# Altium project Supply_unit-RM_1.PrjPcb
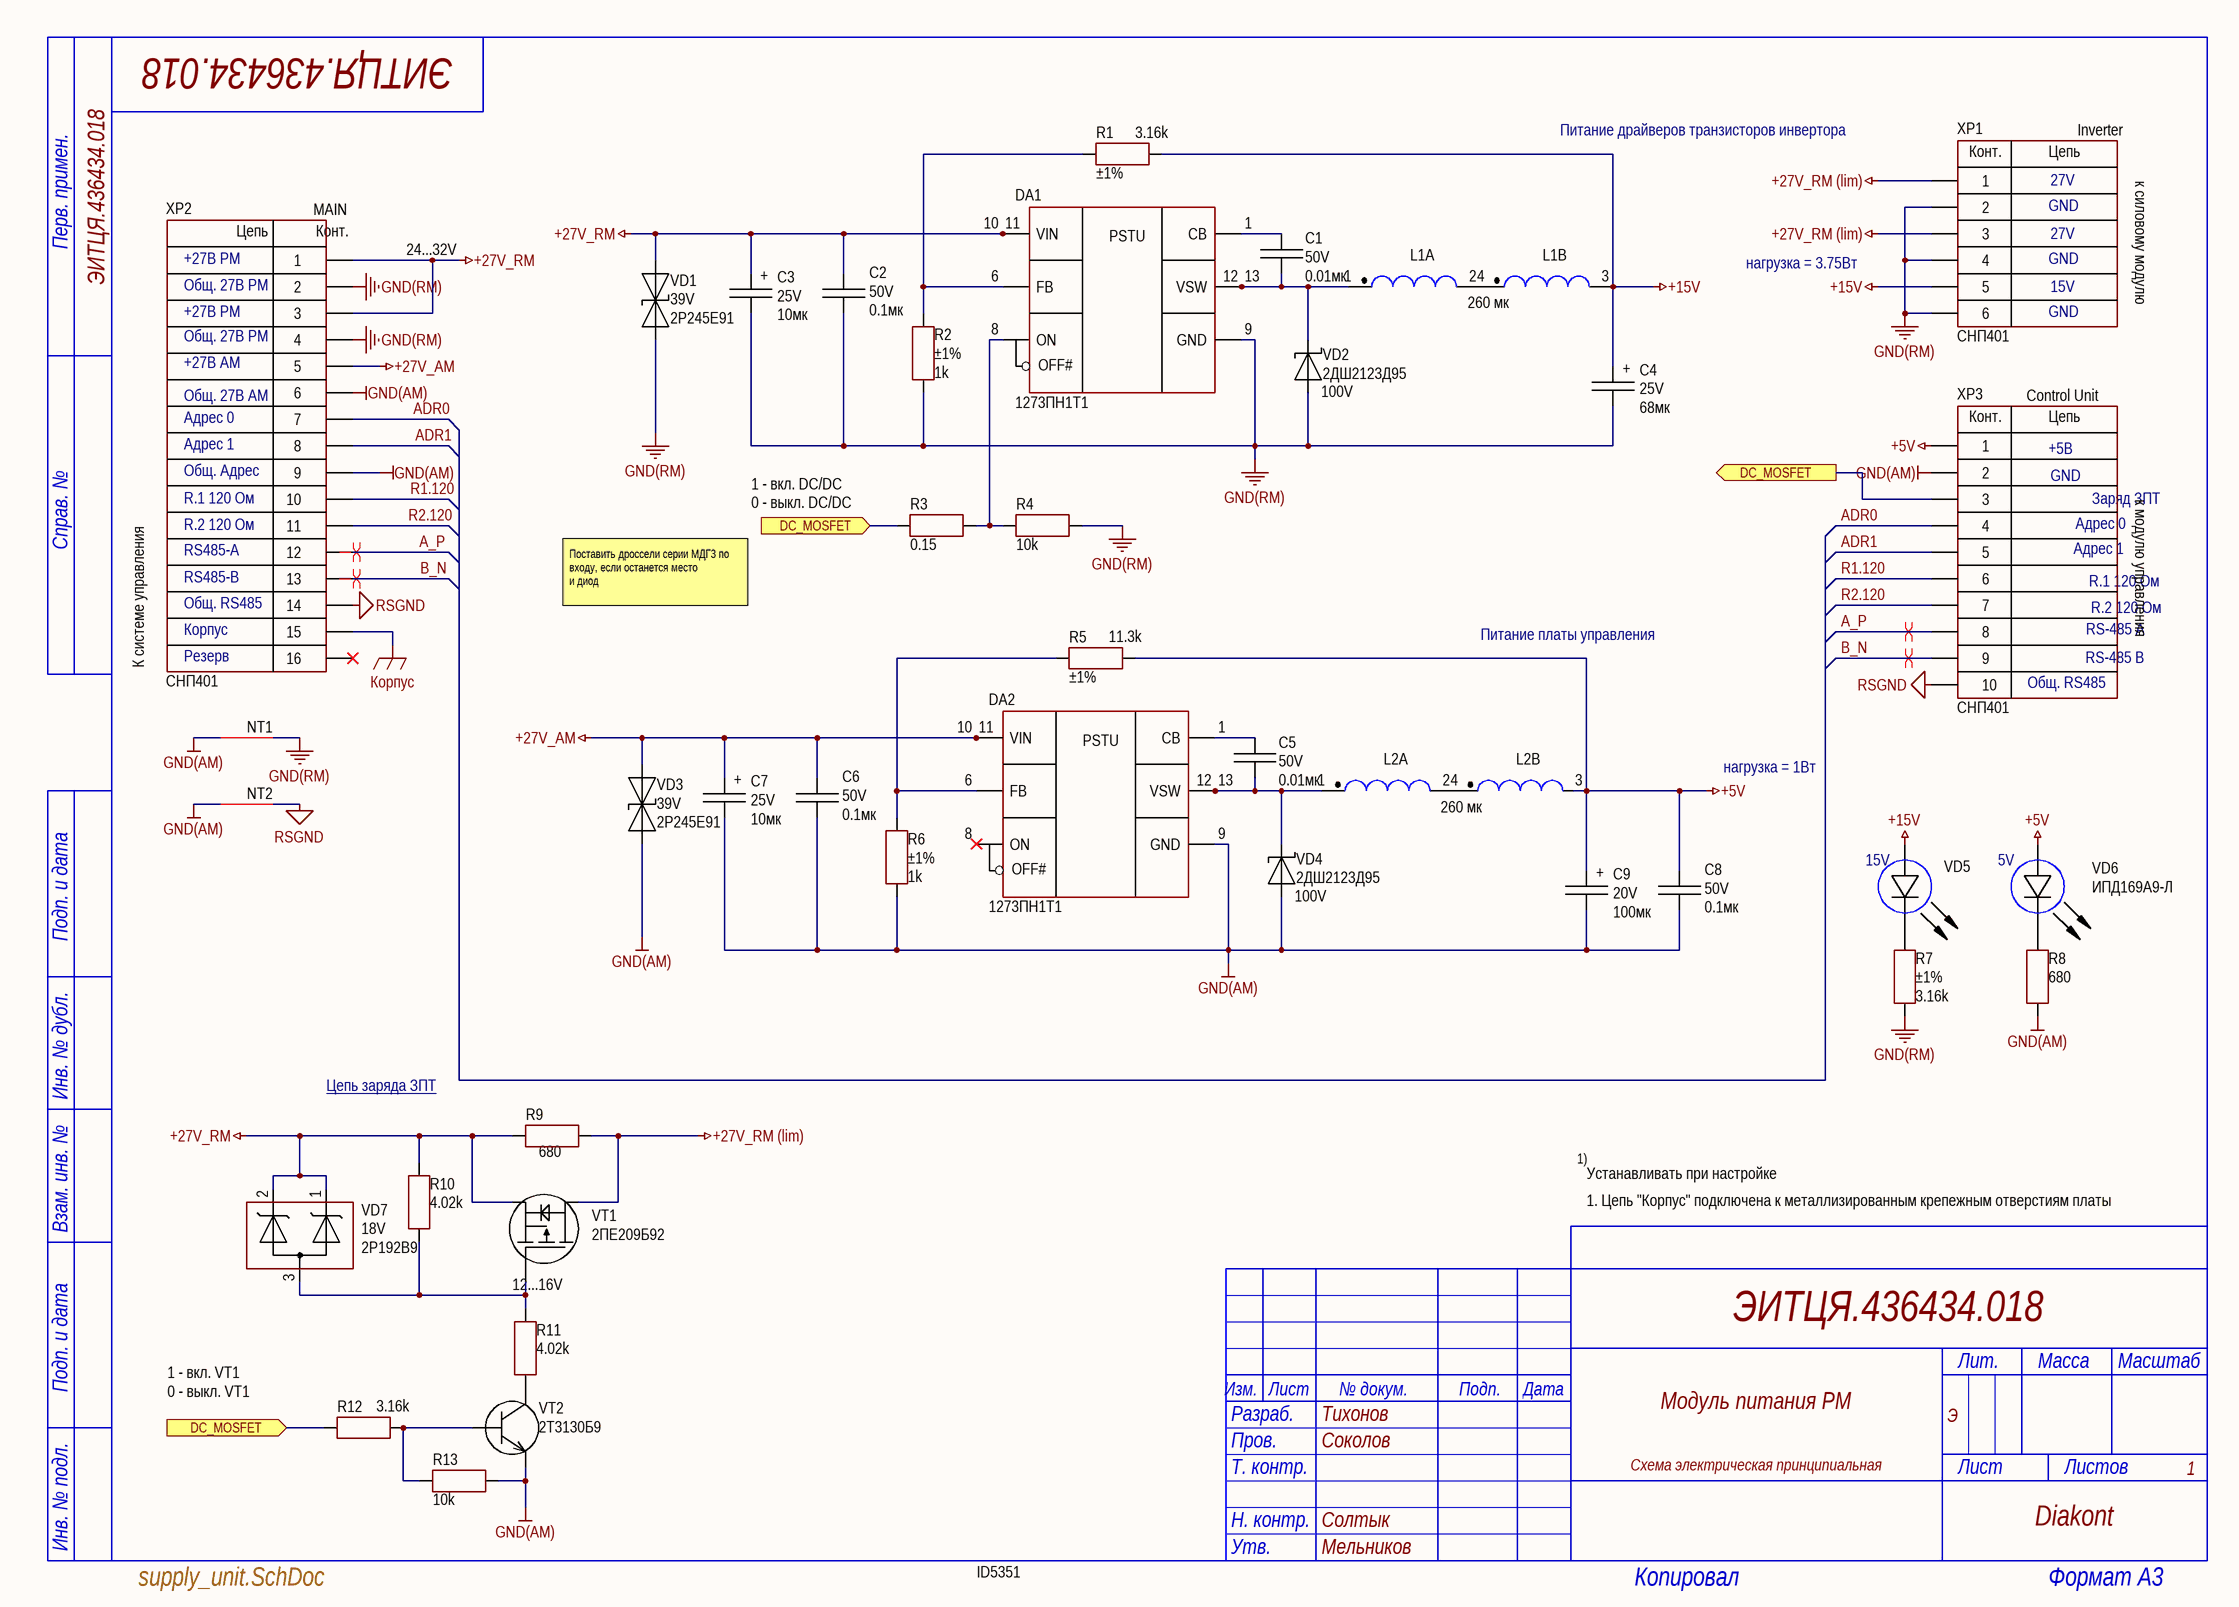
[diagram p0: supply_unit.SchDoc]
1 sheet, 40 parts. Net scope: flat (ports and power ports of the same name join across sheets).
Board file: PCB_supply unit.PcbDoc

## Sheet supply_unit.SchDoc: Модуль питания РМ
size 420 x 297 mm; Date: 2019-11-22; ApprovedBy: Мельников; CheckedBy: Соколов; CompanyName: Diakont; DrawnBy: Тихонов; DocumentNumber: ЭИТЦЯ.436434.018; Revision: A; SheetTotal: 1; DocumentType: Схема электрическая принципиальная; Liter: Э; NormControl: Солтык; PageSetup: Record=PageOptions|CenterHorizontal=True|CenterVertical=True|PrintScale=0.96|XCorrection=1.00|YCorrection=1.00|PrintKind=1|BorderSize=5000000|LeftOffset=0|BottomOffset=0|Orientation=2|PaperLength=1000|PaperWidth=1000|Scale=100|PaperSource=7|PrintQuality=-4|MediaType=1|DitherType=10|PaperKind=A3|PrintScaleMode=1; FirstApp: ЭИТЦЯ.436434.018; Language: en; ResponsibleDept: DED; DocumentStatus: Released; DecimalNumber: {DecimalNumber}

### Parts
C1  value 0.01мк  Voltage: 50V  [CAP: 0603+0805]
C2  value 0.1мк  Voltage: 50V  [CAP: 0805+1206]
C3  value 10мк  Polarity: +  Voltage: 25V  [CAP: TANTAL-E]
C4  value 68мк  Polarity: +  Voltage: 25V  [CAP: TANTAL-E]
C5  value 0.01мк  Voltage: 50V  [CAP: 0603+0805]
C6  value 0.1мк  Voltage: 50V  [CAP: 0805+1206]
C7  value 10мк  Polarity: +  Voltage: 25V  [CAP: TANTAL-E]
C8  value 0.1мк  Voltage: 50V  [CAP: 0805+1206]
C9  value 100мк  Polarity: +  Voltage: 20V  [CAP: TANTAL-E]
DA1  (no value)  [401.14-5М]
DA2  (no value)  [401.14-5М]
L1  value 260 мк  [IND: DFPK7_5]  (hidden comment: ДФПК7,5-2/x)  (parts A,B of 2)
L2  value 260 мк  [IND: DFPK7_5]  (hidden comment: ДФПК7,5-2/x)  (parts A,B of 2)
NT1  (no value)  [NetTie_0603]  (net tie, no BOM)
NT2  (no value)  [NetTie_0603]  (net tie, no BOM)
R1  value 3.16k  Tolerance: ±1%  [RES: 0603P]
R2  value 1k  Tolerance: ±1%  [RES: 0603P]
R3  value 0.15  [RES: 0603P]
R4  value 10k  [RES: 0603P]
R5  value 11.3k  Tolerance: ±1%  [RES: 0603P]
R6  value 1k  Tolerance: ±1%  [RES: 0603P]
R7  value 3.16k  Tolerance: ±1%  [RES: 0603P]
R8  value 680  [RES: 0603P]
R9  value 680  [RES: 0805P]
R10  value 4.02k
R11  value 4.02k
R12  value 3.16k  [RES: 0603P]
R13  value 10k  [RES: 0603P]
VD1  Voltage: 39V  PartNumber: 2Р245Е91  [DIODE: SMB]
VD2  Voltage: 100V  PartNumber: 2ДШ2123Д95  [КТ-99-1]  (hidden comment: ВЗПП Сборка Воронеж)
VD3  Voltage: 39V  PartNumber: 2Р245Е91  [DIODE: SMB]
VD4  Voltage: 100V  PartNumber: 2ДШ2123Д95  [КТ-99-1]  (hidden comment: ВЗПП Сборка Воронеж)
VD5  CommentText: 15V  [LED: 0603G]
VD6  PartNumber: ИПД169А9-Л  CommentText: 5V  [LED: 0603G]
VD7  Voltage: 18V  PartNumber: 2Р192В9  [SOT23]
VT1  PartNumber: 2ПЕ209Б92  [DPAK]
VT2  PartNumber: 2Т3130Б9  [SOT23]
XP1  CommentText: СНП401  [CON: M80-5000605]
XP2  CommentText: СНП401  [CON: M80-5001605]
XP3  CommentText: СНП401  [CON: HR M80-500S10]

### Ports
DC_MOSFET (in), DC_MOSFET (out)

### Nets
+5V: C8.2 C9.2 L2.3 R5.2 VD6.1(A) XP3.1
+15V: C4.2 L1.3 R1.2 VD5.1(A) XP1.5
+27V_AM: C6.2 C7.2 DA2.10(VIN) DA2.11(VIN) VD3.2(C) XP2.5
+27V_RM: C2.2 C3.2 DA1.10(VIN) DA1.11(VIN) R9.1 R10.1 VD1.2(C) VD7.1(K1) VD7.2(K2) VT1.2(S) XP2.1 XP2.3
+27V_RM (lim): R9.2 VT1.3(D) XP1.1 XP1.3
GND(AM): C6.1 C7.1 C8.1 C9.1 DA2.9(GND) NT1.1 NT2.1 R6.2 R8.2 R13.1 VD3.1(A) VD4.A VT2.2(E) XP2.6 XP2.9 XP3.2
GND(RM): C2.1 C3.1 C4.1 DA1.9(GND) NT1.2 R2.2 R4.1 R7.1 VD1.1(A) VD2.A XP1.2 XP1.4 XP1.6 XP2.2 XP2.4
RSGND: NT2.2 XP2.14 XP3.10
Корпус: XP2.15
A_P: XP2.12 XP3.8
ADR0: XP2.7 XP3.4
ADR1: XP2.8 XP3.5
B_N: XP2.13 XP3.9
DC_MOSFET: R3.1 R12.1 XP3.3 ; port DC_MOSFET
R1.120: XP2.10 XP3.6
R2.120: XP2.11 XP3.7
NetC1_1: C1.1 DA1.12(VSW) DA1.13(VSW) L1.1 VD2.C
NetC1_2: C1.2 DA1.1(CB)
NetC5_1: C5.1 DA2.12(VSW) DA2.13(VSW) L2.1 VD4.C
NetC5_2: C5.2 DA2.1(CB)
NetDA1_6: DA1.6(FB) R1.1 R2.1
NetDA1_8: DA1.8(ON) R3.2 R4.2
NetDA2_6: DA2.6(FB) R5.1 R6.1
NetL1_2: L1.2 L1.4
NetL2_2: L2.2 L2.4
NetR7_2: R7.2 VD5.2(C)
NetR8_1: R8.1 VD6.2(C)
NetR10_2: R10.2 R11.1 VD7.3(A) VT1.1(G)
NetR11_2: R11.2 VT2.3(C)
NetR12_2: R12.2 R13.2 VT2.1(B)

Not connected (* = marked no-connect by the designer): DA2 8(ON)*; XP2 16*

### Layout directives
differential pair: (no net found under the mark), A_P, B_N

### Notes on the sheet
- Питание драйверов транзисторов инвертора
- 27V
- Inverter
- к силовому модулю
- +27В РМ
- (near XP2) MAIN
- (near XP2) 24...32V
- GND
- (near XP2) Общ. 27В РМ
- (near L1) нагрузка = 3.75Вт
- 15V
- (near XP2) Общ. 27В АМ
- +27В АМ
- Control Unit
- Адрес 0
- Адрес 1
- +5В
- К системе управления
- R.1 120 Ом
- R.2 120 Ом
- Общ. Адрес
- (near R3) 1 - вкл. DC/DC
  0 - выкл. DC/DC
- Заряд ЗПТ
- к модулю управления
- RS485-A
- RS485-B
- Поставить дроссели серии МДГ3 по входу, если останется место
  и диод
- (near XP3) R.1 120 Ом
- Общ. RS485
- Корпус
- Резерв
- Питание платы управления
- RS-485 B
- RS-485 A
- (near XP3) R.2 120 Ом
- (near L2) нагрузка = 1Вт
- Цепь заряда ЗПТ
- 1)
- Устанавливать при настройке
- 1. Цепь "Корпус" подключена к металлизированным крепежным отверстиям платы
- (near VT1) 12...16V
- 1 - вкл. VT1
  0 - выкл. VT1
- ID5351
- Перв. примен.
- Справ. №
- Подп. и дата
- Инв. № дубл.
- Взам. инв. №
- Изм.
- Лист
- № докум.
- Подп.
- Дата
- Лит.
- Масса
- Масштаб
- Разраб.
- Пров.
- Т. контр.
- Листов
- Инв. № подл.
- Н. контр.
- Утв.
- Копировал
- Формат A3
- (in symbol 1273ПН1T1) PSTU; OFF#
- (in symbol M80-5000605 Harwin) Конт.; Цепь
- (in symbol M80-5001005 Harwin) Конт.; Цепь
- (in symbol M80-5001205 Harwin_1) Цепь; Конт.

### Library data of the parts
C1 C5 = Ceramic_0603: Manufacturer: Монолит; PartNumber: К10-84в-1608М-50В-0,01 мкФ ±10%-Н20-N-A; ValueManufacturerPartNumber: Ceramic capacitor, 0.01мк, Н20, ±10%, 50V, 0603,; TypeCapacitor: Ceramic capacitor; Tolerance: ±10%; TypeDielectric: Н20; Analog: MAX 00123301 (K10-17в - 0805); Package: 0603; HelpURL: http://www.monolit.vitebsk.by/Files/K10-84.pdf
C2 C6 C8 = Ceramic_1210: Manufacturer: Монолит; PartNumber: К10-84в-2012М-50В-0,1 мкФ +80/-20%-Н90-N-A; ValueManufacturerPartNumber: Ceramic capacitor, 0.1мк, Н20, ±10%, 50V, 0805,; TypeCapacitor: Ceramic capacitor; Tolerance: ±10%; TypeDielectric: Н20; Analog: MAX 00123747 (К10-17в - с1206); Package: 0805; HelpURL: http://www.monolit.vitebsk.by/Files/K10-84.pdf
C3 C7 = Tantal_E: Manufacturer: Элеконд; PartNumber: К53-68 "E"-50 В-10мкф ±10%; ValueManufacturerPartNumber: Tantalum capacitor, 10мк, 25V, ±10%, 0.7 Ом, case E, -60...+125°C; Impedance: 0.7 Ом; Tolerance: ±10%; TypeCapacitor: Tantalum capacitor; MAX: 00145440; Analog: 00132739 (pin-to-pin на 15мкФ); Package: case E; HelpURL: https://eandc.ru/pdf/kondensator/k53-68.pdf; Temperature: -60...+125°C
C4 = Tantal_E: Manufacturer: Элеконд; PartNumber: К53-68 "E"-25 В-68мкф ±10%; ValueManufacturerPartNumber: Tantalum capacitor, 68мк, 25V, ±10%, 0.7 Ом, case E, -60...+125°C; Impedance: 0.7 Ом; Tolerance: ±10%; TypeCapacitor: Tantalum capacitor; MAX: 00145468; Package: case E; HelpURL: https://eandc.ru/pdf/kondensator/k53-68.pdf; Temperature: -60...+125°C
C9 = Tantal_E: Manufacturer: Элеконд; PartNumber: К53-68 "E"-20 В-100 мкф ±10%; ValueManufacturerPartNumber: Tantalum capacitor, 100мк, 20V, ±10%, 0.5-0.7 Ом, case E, -60...+125°C; Impedance: 0.5-0.7 Ом; Tolerance: ±10%; TypeCapacitor: Tantalum capacitor; MAX: 00129948; Package: case E; HelpURL: https://eandc.ru/pdf/kondensator/k53-68.pdf; Temperature: -60...+125°C
DA1 DA2 = 1273ПН1T1: USSR Buck converter; Manufacturer: НИИЭТ; ValueManufacturerPartNumber: DC/DC buck converter, input 8...40V, 260 кHz, output 1.21...37V, 1A, -60...+115°C, 401.14-5М; VoltageInput: input 8...40V; Frequency: 260 кHz; CurrentOutput: 1A; VoltageOutput: output 1.21...37V; Analog: LM2675-ADJ; HelpURL: https://niiet.ru/product/id33; Package: 401.14-5М; ComponentType: DC/DC buck converter; Temperature: -60...+115°C; PartNumber: 1273ПН1T1
L1 L2 = ДФПК7,5-2/x: Дроссель фильтрации; Manufacturer: АЛЕКСАНДЕР ЭЛЕКТРИК; PartNumber: ДФПК7,5-2/0.8; TU: БКЮС.670109.002-01 ТУ; Tolerance: *; RefDes/Designator: *; Pattern/Footprint: *; Published: 19.02.2015; Type: Дроссель фильтрации; HelpURL: http://www.aeip.ru/production/drosseli-filtratsii/seriya-df-dfk-dfp-dfpk/
NT1 NT2 = NetTie
R1 R7 = Resistor_0603: Manufacturer: ОАО Ресурс; PartNumber: Р1-12-0,1ум.-3.16~кОм ±1%-М ШКАБ.434110.002 ТУ; ValueManufacturerPartNumber: Resistor film, 3.16k, ±1%, 0603, 0.1W, -55...+125°C; TypeResistor: Resistor film; Power: 0.1W; MAX: 00134464; Package: 0603; HelpURL: https://aoresurs.com/catalog/chip_rezistory/rezistory-r1-12-kategoriya-kachestva-vp-/; Temperature: -55...+125°C
R2 R6 = Resistor_0603: Manufacturer: ОАО Ресурс; PartNumber: Р1-12-0,1ум.-1~кОм ±1%-М ШКАБ.434110.002 ТУ; ValueManufacturerPartNumber: Resistor film, 1k, ±1%, 0603, 0.1W, -55...+125°C; TypeResistor: Resistor film; Power: 0.1W; MAX: 00133971; Package: 0603; HelpURL: https://aoresurs.com/catalog/chip_rezistory/rezistory-r1-12-kategoriya-kachestva-vp-/; Temperature: -55...+125°C
R3 = Resistor_0603: Manufacturer: ОАО Ресурс; PartNumber: Р1-12-0,1ум.-0.15~Ом ±20%-М ШКАБ.434110.002 ТУ; ValueManufacturerPartNumber: Resistor film, 0.15, ±20%, 0603, 0.1W, -55...+125°C; TypeResistor: Resistor film; Power: 0.1W; Tolerance: ±20%; MAX: 00133968; Analog: MAX 00117169 pin-to-pin; Package: 0603; HelpURL: https://aoresurs.com/catalog/chip_rezistory/rezistory-r1-12-kategoriya-kachestva-vp-/; Temperature: -55...+125°C
R4 R13 = Resistor_0603: Manufacturer: ОАО Ресурс; PartNumber: Р1-12-0,1ум.-10~кОм ±5%-М ШКАБ.434110.002 ТУ; ValueManufacturerPartNumber: Resistor film, 10k, ±5%, 0603, 0.1W, -55...+125°C; TypeResistor: Resistor film; Power: 0.1W; Tolerance: ±5%; Analog: MAX 00133986 (1%); Package: 0603; HelpURL: https://aoresurs.com/catalog/chip_rezistory/rezistory-r1-12-kategoriya-kachestva-vp-/; Temperature: -55...+125°C
R5 = Resistor_0603: Manufacturer: ОАО Ресурс; PartNumber: Р1-12-0,1ум.-11.3~кОм ±1%-М ШКАБ.434110.002 ТУ; ValueManufacturerPartNumber: Resistor film, 11.3k, ±1%, 0603, 0.1W, -55...+125°C; TypeResistor: Resistor film; Power: 0.1W; Analog: 00133993 (pin-to-pin 11k 5%); Package: 0603; HelpURL: https://aoresurs.com/catalog/chip_rezistory/rezistory-r1-12-kategoriya-kachestva-vp-/; Temperature: -55...+125°C
R8 = Resistor_0603: Manufacturer: ОАО Ресурс; PartNumber: Р1-12-0,1ум.-680~Ом ±5%-М ШКАБ.434110.002 ТУ; ValueManufacturerPartNumber: Resistor film, 680, ±5%, 0603, 0.1W, -55...+125°C; TypeResistor: Resistor film; Power: 0.1W; Tolerance: ±5%; MAX: 00134086; Package: 0603; HelpURL: https://aoresurs.com/catalog/chip_rezistory/rezistory-r1-12-kategoriya-kachestva-vp-/; Temperature: -55...+125°C
R9 = Resistor_0805: Manufacturer: Ресурс; PartNumber: Р1-12-0,125-680 Ом ±5%-М ШКАБ.434110.002 ТУ; ValueManufacturerPartNumber: Resistor film, 680, ±5%, 0805, 0.125W,; TypeResistor: Resistor film; Power: 0.125W; Tolerance: ±5%; MAX: 00133924; Package: 0805; HelpURL: https://aoresurs.com/catalog/chip_rezistory/rezistory-r1-12-kategoriya-kachestva-vp-/
R10 = Resistor_0603: Manufacturer: ОАО Ресурс; PartNumber: Р1-12-0,1ум.-4.02~кОм ±1%-М ШКАБ.434110.002 ТУ; ValueManufacturerPartNumber: Resistor film, 4.02k, ±1%, 0805, 0.125W, -55...+125°C; TypeResistor: Resistor film; Power: 0.125W; Tolerance: ±1%; MAX: 00123886; Package: 0805; HelpURL: https://aoresurs.com/catalog/chip_rezistory/rezistory-r1-12-kategoriya-kachestva-vp-/; Temperature: -55...+125°C
R11 = Resistor_0603: Manufacturer: ОАО Ресурс; PartNumber: Р1-12-0,1ум.-4.02~кОм ±1%-М ШКАБ.434110.002 ТУ; ValueManufacturerPartNumber: Resistor film, 4.02k, ±1%, 0805, 0.125W, -55...+125°C; TypeResistor: Resistor film; Power: 0.125W; Tolerance: ±1%; Analog: 00123886; Package: 0805; HelpURL: https://aoresurs.com/catalog/chip_rezistory/rezistory-r1-12-kategoriya-kachestva-vp-/; Temperature: -55...+125°C
R12 = Resistor_0603: Manufacturer: ОАО Ресурс; PartNumber: Р1-12-0,1ум.-3.16~кОм ±1%-М ШКАБ.434110.002 ТУ; ValueManufacturerPartNumber: Resistor film, 3.16k, ±1%, 0603, 0.1W, -55...+125°C; TypeResistor: Resistor film; Power: 0.1W; Tolerance: ±1%; MAX: 00134464; Package: 0603; HelpURL: https://aoresurs.com/catalog/chip_rezistory/rezistory-r1-12-kategoriya-kachestva-vp-/; Temperature: -55...+125°C
VD1 VD3 = TVS_single: Manufacturer: НЗПП; TypeDiode: Zener diode; Current: 8A; VoltageDrop: 0.9V; Analog: SMA6J33A; Package: SMB(КД-42); HelpURL: http://www.nzpp.ru/product/; ValueManufacturerPartNumber: =TypeDiode+', '+Voltage+', '+Current+', '+VoltageDrop+', '+RecoveryTime+', '+Package+', '+Temperature
VD2 VD4 = Schottky_single: TypeDiode: Schottky diode; Current: 1А; VoltageDrop: 0.78; Analog: MAX 00143791 (pin-to-pin).Впритык(40В); Manufacturer: ВЗПП Сборка Воронеж; Package: КТ-99-1; ValueManufacturerPartNumber: ВЗПП Сборка Воронеж
VD5 = LED_single: Manufacturer: Протон; ValueManufacturerPartNumber: LED, 20mA max, 2.1V typ, 1608, -55...+150°C; PartNumber: ИПД169А9-Л; TypeDiode: LED; Current: 20mA max; VoltageDrop: 2.1V typ; Color: GREEN; Analog: MAX 00129484 КР-1608 Kingbright (pin-to-pin); Package: 1608; HelpURL: *; Temperature: -55...+150°C
VD6 = LED_single: Manufacturer: Протон; ValueManufacturerPartNumber: LED, 20mA max, 2.1V typ, 1608, -55...+150°C; TypeDiode: LED; Current: 20mA max; VoltageDrop: 2.1V typ; Color: GREEN; Analog: MAX 00129484 КР-1608 Kingbright (pin-to-pin); Package: 1608; HelpURL: *; Temperature: -55...+150°C
VD7 = TVS_array_var2: Manufacturer: КРИП; TypeDiode: TVS diode; Current: 1A; Uогр.: 22.5V; Cap: 21pF; NOTE: указано для pin1-pin3; Analog: КР192А9 (ОТК) (pin-to-pin); Package: SOT-23; ValueManufacturerPartNumber: =TypeDiode+', '+Voltage+', '+Current+', '+VoltageDrop+', '+RecoveryTime+', '+Package+', '+Temperature; Temperature: -55...+150°C
VT1 = MOSFET_P_132: Manufacturer: Ангстрем; ValueManufacturerPartNumber: MOSFET P-channel transistor, 60V, 22A, 2.9nC, 2.5W, 40mOhm, 220pF, KT-89 (DPAK/TO-252), -55...+150°C; TypeTransistor: MOSFET P-channel transistor; VoltageDS: 60V; CurrentDS: 22A; RDS: 40mOhm; GateCharge: 2.9nC; InputCapacitor: 220pF; MaxPower: 2.5W; Analog: SUD50P06-15 (pin-to-pin); Package: KT-89 (DPAK/TO-252); HelpURL: https://www.vishay.com/docs/68940/sud50p06-15.pdf; Temperature: -55...+150°C
VT2 = BJT_NPN_132: Manufacturer: ООО НПК Далекс; ValueManufacturerPartNumber: NPN transistor, 30V, 100mA, , 300mW, 0.7V, 500, SOT-23 (КТ-46), -55...+125°C; TypeTransistor: NPN transistor; VoltageCE: 30V; CurrentCE: 100mA; VoltageSaturation: 0.7V; CurrentGain: 500; MaxPower: 300mW; MAX: 00123842; Package: SOT-23 (КТ-46); HelpURL: http://www.radioman-portal.ru/sprav/pp/transisters/sourse/2t3130.pdf; Temperature: -55...+125°C
XP1 = M80-5000605 Harwin: вилка на плату; Manufacturer: Электроделать; ValueManufacturerPartNumber: Вилка, 6pin, 2mm, 120VAC, 1.5A; PartNumber: СНП401-6ВП21-3-1-1; VoltageMax: 120VAC; Pitch: 2mm; CurrentMax: 1.5A; Multichannel: 6pin; Analog: MAX 00126397 (M80-5000605 pin-to-pin); HelpURL: https://eu.mouser.com/ProductDetail/Harwin/M80-5000605?qs=yQtJ9TWM%2F1KaJIUUBEXorg%3D%3D; TypeConnector: Вилка
XP2 = M80-5001205 Harwin_1: вилка на плату; Manufacturer: Электродеталь; ValueManufacturerPartNumber: , 16pin, 2mm, 120VAC, 1.5A; PartNumber: СНП401-16ВП21-3-1-1; VoltageMax: 120VAC; Pitch: 2mm; CurrentMax: 1.5A; Multichannel: 16pin; Analog: MAX 00139241 [М80-5101605] (pin-to-pin); HelpURL: https://www.digikey.com/product-detail/en/harwin-inc/M80-5001605/952-2626-ND/5175716
XP3 = M80-5001005 Harwin: вилка на плату; Manufacturer: Электродеталь; ValueManufacturerPartNumber: Вилка, 10pin, 2mm, 100V, 1.5A; PartNumber: СНП401-10ВП21-3-1-1; VoltageMax: 100V; Pitch: 2mm; CurrentMax: 1.5A; Multichannel: 10pin; Analog: MAX 00126377 (M80-5001042 pin-to-pin); HelpURL: https://eu.mouser.com/ProductDetail/Harwin/M80-5001005?qs=yQtJ9TWM%2F1KRz59nPe3lqQ%3D%3D; TypeConnector: Вилка